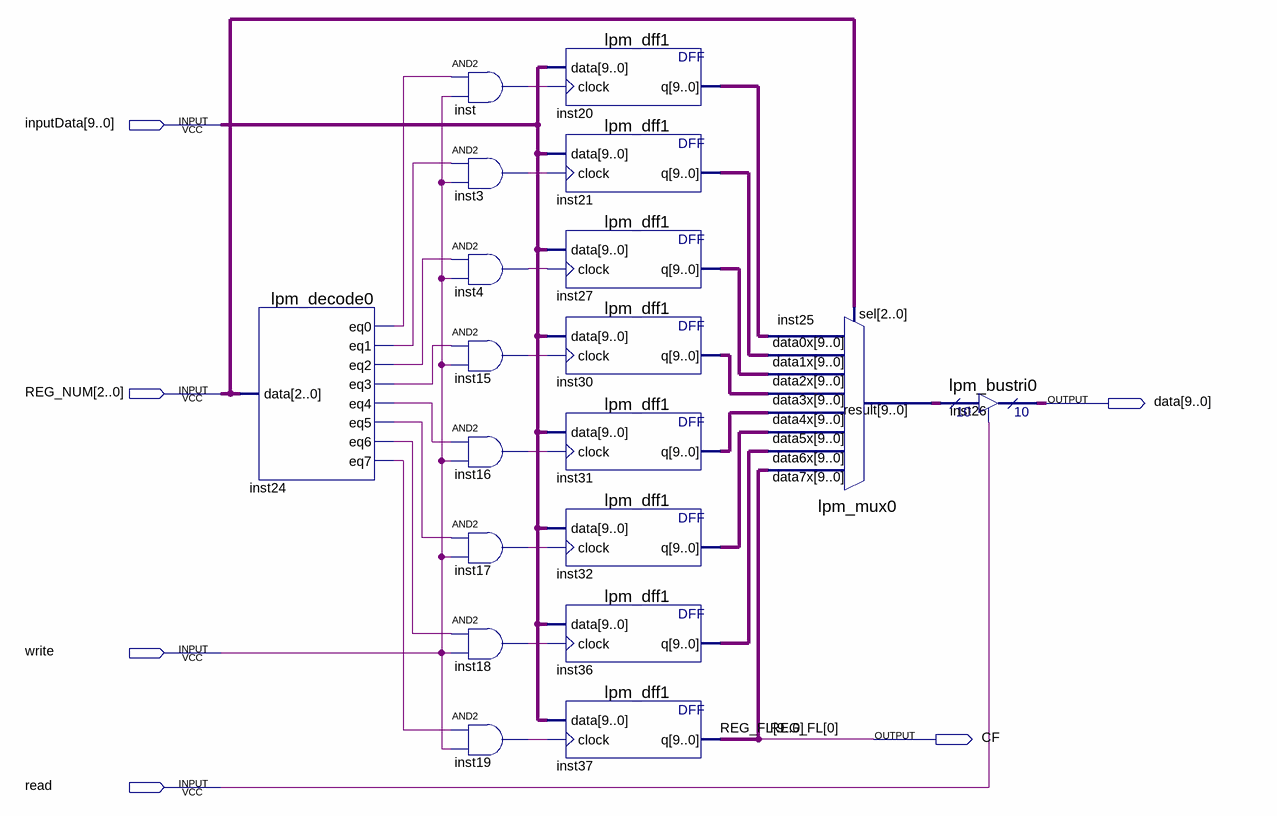
[diagram p0: schematic sheet]
// Quartus schematic GPR.bdf as structural Verilog: 19 symbols, 6 pins
module GPR (
  input  [9:0] inputData,
  input  [2:0] REG_NUM,
  input  write,
  input  read,
  output [9:0] data,
  output CF
);

  wire inst3_out, inst4_out, inst15_out, inst16_out, inst17_out, inst18_out, inst19_out, inst24_eq0,
       inst24_eq1, inst24_eq2, inst24_eq3, inst24_eq4, inst24_eq5, inst24_eq6, inst24_eq7, inst_out;
  wire [9:0] inst20_q, inst21_q, inst25_result, inst27_q, inst30_q, inst31_q, inst32_q, inst36_q;
  wire [9:1] REG_FL;

  lpm_decode0 inst24 (
    .data(REG_NUM), .eq0(inst24_eq0), .eq1(inst24_eq1), .eq2(inst24_eq2), .eq3(inst24_eq3), .eq4(inst24_eq4),
    .eq5(inst24_eq5), .eq6(inst24_eq6), .eq7(inst24_eq7));
  and inst (inst_out, inst24_eq0, write);
  and inst3 (inst3_out, inst24_eq1, write);
  and inst4 (inst4_out, inst24_eq2, write);
  and inst15 (inst15_out, inst24_eq3, write);
  and inst16 (inst16_out, inst24_eq4, write);
  and inst17 (inst17_out, inst24_eq5, write);
  and inst18 (inst18_out, inst24_eq6, write);
  and inst19 (inst19_out, inst24_eq7, write);
  lpm_dff1 inst20 (.data(inputData), .clock(inst_out), .q(inst20_q));
  lpm_dff1 inst21 (.data(inputData), .clock(inst3_out), .q(inst21_q));
  lpm_dff1 inst27 (.data(inputData), .clock(inst4_out), .q(inst27_q));
  lpm_dff1 inst30 (.data(inputData), .clock(inst15_out), .q(inst30_q));
  lpm_dff1 inst31 (.data(inputData), .clock(inst16_out), .q(inst31_q));
  lpm_dff1 inst32 (.data(inputData), .clock(inst17_out), .q(inst32_q));
  lpm_dff1 inst36 (.data(inputData), .clock(inst18_out), .q(inst36_q));
  lpm_dff1 inst37 (.data(inputData), .clock(inst19_out), .q({REG_FL, CF}));
  lpm_mux0 inst25 (
    .data7x({REG_FL, CF}), .data6x(inst36_q), .data5x(inst32_q), .data4x(inst31_q), .data3x(inst30_q),
    .data2x(inst27_q), .data1x(inst21_q), .data0x(inst20_q), .sel(REG_NUM), .result(inst25_result));
  lpm_bustri0 inst26 (.enabledt(read), .data(inst25_result), .tridata(data));

  // Other names for the same wires on the sheet: REG_FL[0] = CF
endmodule
